# EAGLE design gt_cam_revf (EAGLE 9.4.2)

## Sheet 1 of 3
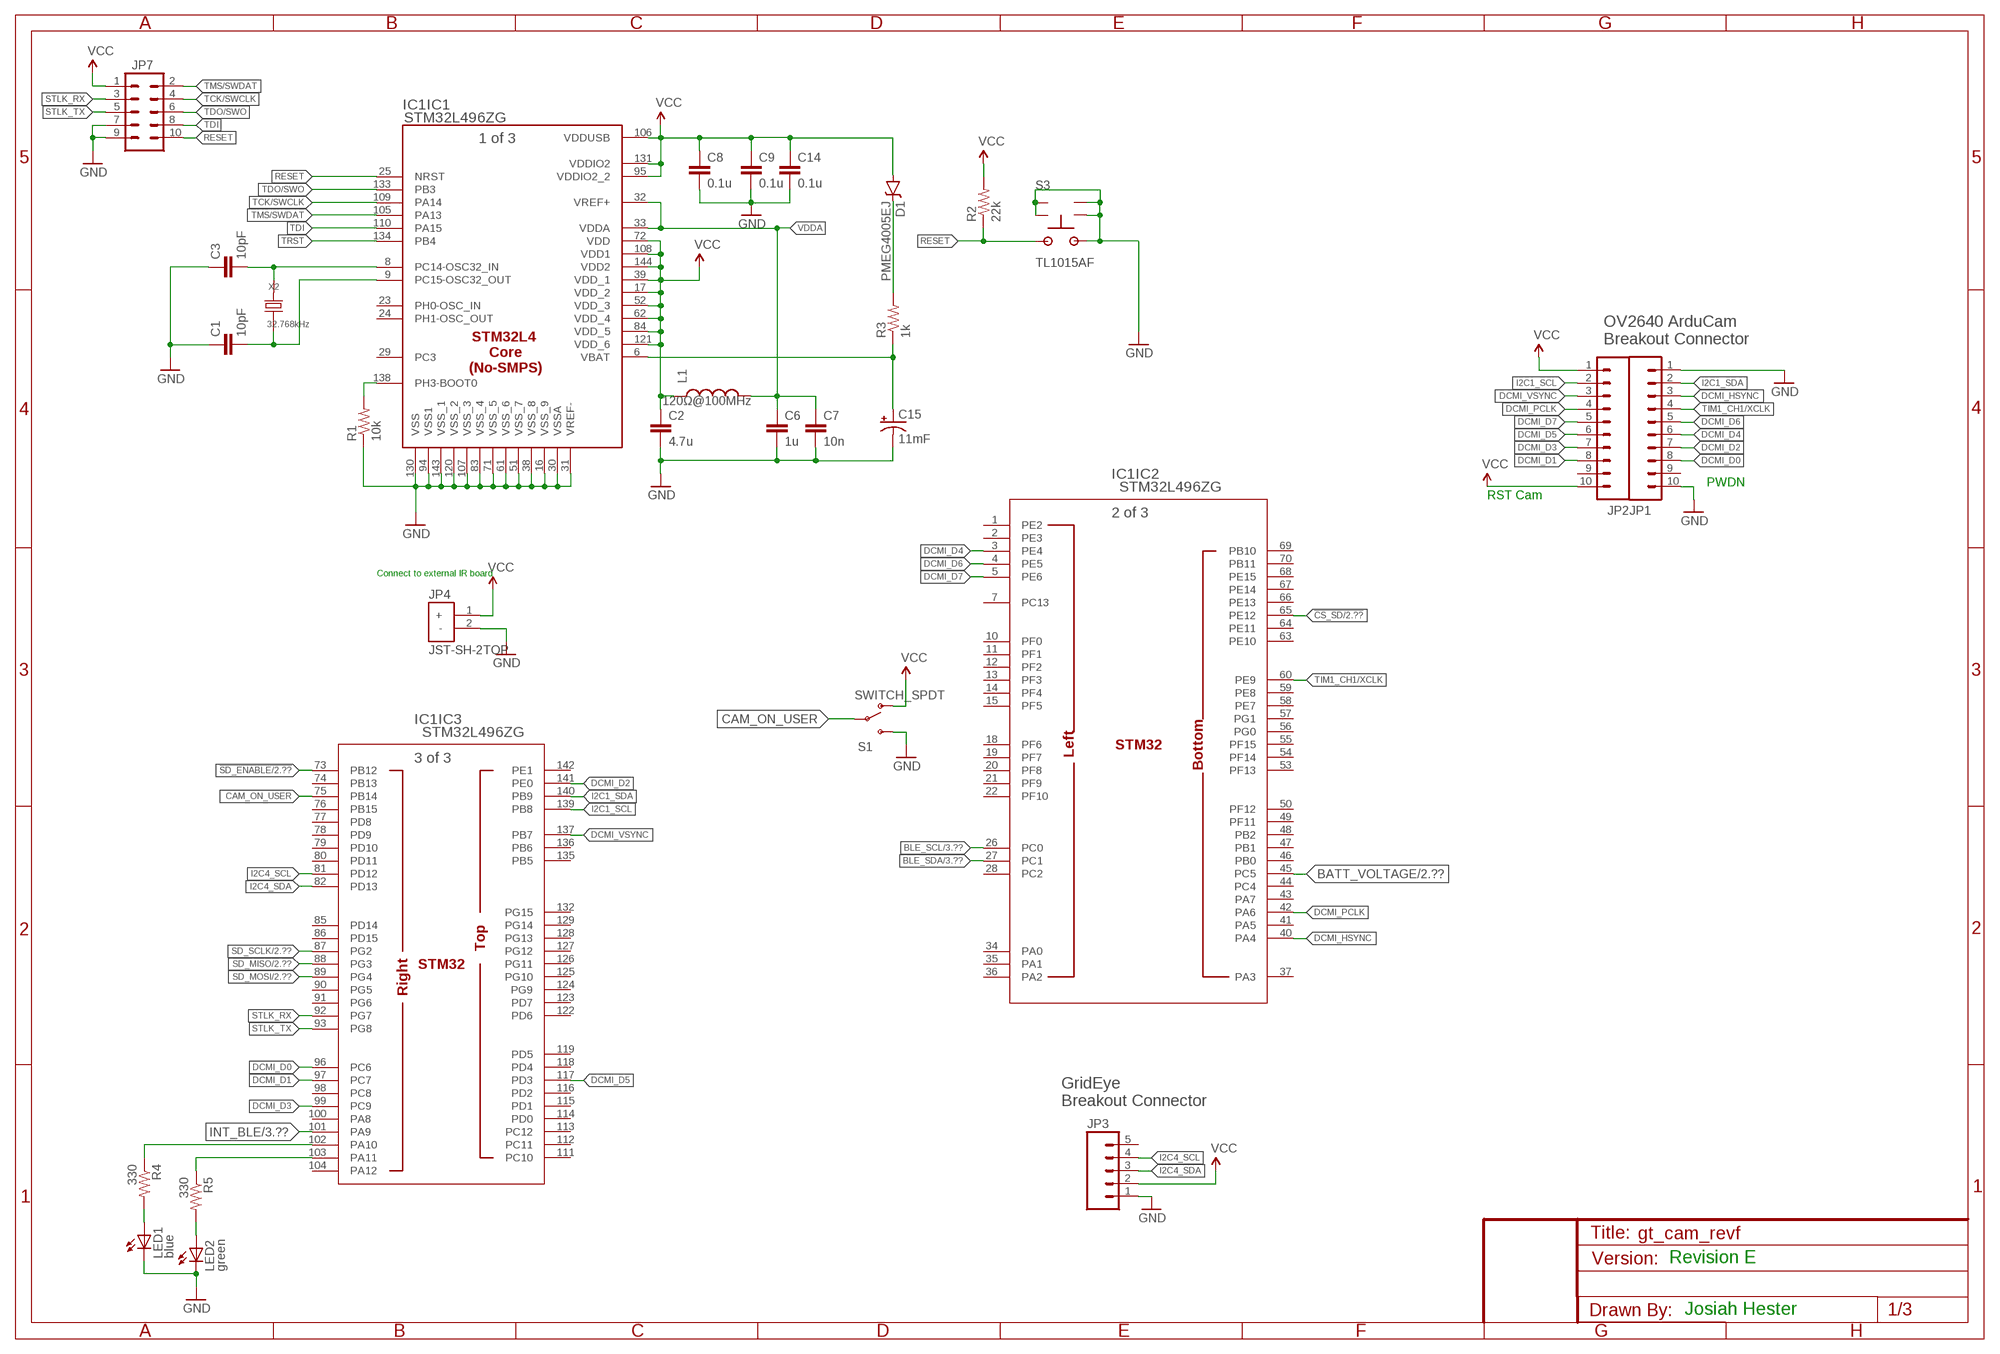
[diagram p0: schematic, sheet 1]

### Parts
C1  10pF  C-EU0603  [0603]
C2  4.7u  CAP0805  [0805]
C3  10pF  C-EU0603  [0603]
C6  1u  C-EU0603  [0603]
C7  10n  C-EU0603  [0603]
C8  0.1u  C-EU0603  [0603]
C9  0.1u  C-EU0603  [0603]
C14  0.1u  C-EU0603  [0603]
C15  11mF  CAP_POL1206  [EIA3216]
D1  PMEG4005EJ  DIODE-SCHOTTKY-PMEG4005EJ  [SOD-323]
IC1  STM32L496ZG  [LQFP144-20X20MM]
JP1  M10SILK_FEMALE_PTH  [1X10]
JP2  M10SILK_FEMALE_PTH  [1X10]
JP3  M05LOCK  [1X05_LOCK]
JP4  JST-SH-2TOP  [JST-SH-2-TOP]
JP7  M05X21.27MM  [2X5_1.27MM]
L1  120Ω@100MHz  L-EU  [0402]
LED1  blue  LED0603  [LED-0603]
LED2  green  LED0603  [LED-0603]
R1  10k  R-EU0603  [0603]
R2  22k  R-EU0603  [0603]
R3  1k  R-EU0603  [0603]
R4  330  R-EU0603  [0603]
R5  330  R-EU0603  [0603]
S1  SWITCH_SPDT  [EG-1213]
S3  TL1015AF  [TS1015]
X2  32.768kHz  FC-135  [FC-135_1PRIMARY]

### Nets
!CS_SD: IC1.65(IC2:PE12) ; also sheet 2
!SD_ENABLE: IC1.73(IC3:PB12) ; also sheet 2
BATT_VOLTAGE: IC1.45(IC2:PC5) ; also sheet 2
BLE_SCL: IC1.26(IC2:PC0) ; also sheet 3
BLE_SDA: IC1.27(IC2:PC1) ; also sheet 3
CAM_ON_USER: IC1.75(IC3:PB14) S1.C
DCMI_D0: IC1.96(IC3:PC6) JP1.8
DCMI_D1: IC1.97(IC3:PC7) JP2.8
DCMI_D2: IC1.141(IC3:PE0) JP1.7
DCMI_D3: IC1.99(IC3:PC9) JP2.7
DCMI_D4: IC1.3(IC2:PE4) JP1.6
DCMI_D5: IC1.117(IC3:PD3) JP2.6
DCMI_D6: IC1.4(IC2:PE5) JP1.5
DCMI_D7: IC1.5(IC2:PE6) JP2.5
DCMI_HSYNC: IC1.40(IC2:PA4) JP1.3
DCMI_PCLK: IC1.42(IC2:PA6) JP2.4
DCMI_VSYNC: IC1.137(IC3:PB7) JP2.3
GND: C1.1 C2.2 C3.1 C6.2 C7.2 C8.2 C9.2 C14.2 C15.C(-) IC1.16(IC1:VSS_9) IC1.30(IC1:VSSA) IC1.31(IC1:VREF-) IC1.38(IC1:VSS_8) IC1.51(IC1:VSS_7) IC1.61(IC1:VSS_6) IC1.71(IC1:VSS_5) IC1.83(IC1:VSS_4) IC1.94(IC1:VSS1) IC1.107(IC1:VSS_3) IC1.120(IC1:VSS_2) IC1.130(IC1:VSS) IC1.143(IC1:VSS_1) JP1.1 JP1.10 JP3.1 JP4.2(-) JP7.7 JP7.9 LED1.C LED2.C R1.1 S1.S S3.1 S3.G1(GND) S3.G2(GND) S3.G3(GND) S3.G4(GND) ; also sheet 2,3
I2C1_SCL: IC1.139(IC3:PB8) JP2.2
I2C1_SDA: IC1.140(IC3:PB9) JP1.2
I2C4_SCL: IC1.81(IC3:PD12) JP3.4
I2C4_SDA: IC1.82(IC3:PD13) JP3.3
INT_BLE: IC1.101(IC3:PA9) ; also sheet 3
N$1: C3.2 IC1.8(IC1:PC14-OSC32_IN) X2.2
N$2: C1.2 IC1.9(IC1:PC15-OSC32_OUT) X2.1
N$5: IC1.138(IC1:PH3-BOOT0) R1.2
N$8: D1.C R3.2
N$12: IC1.103(IC3:PA11) R5.1
N$13: IC1.102(IC3:PA10) R4.1
N$14: LED1.A R4.2
N$15: LED2.A R5.2
RESET: IC1.25(IC1:NRST) JP7.10 R2.1 S3.2
RTC_VBAT: C15.A(+) IC1.6(IC1:VBAT) R3.1
SD_MISO: IC1.88(IC3:PG3) ; also sheet 2
SD_MOSI: IC1.89(IC3:PG4) ; also sheet 2
SD_SCLK: IC1.87(IC3:PG2) ; also sheet 2
STLK_RX: IC1.92(IC3:PG7) JP7.3
STLK_TX: IC1.93(IC3:PG8) JP7.5
TCK/SWCLK: IC1.109(IC1:PA14) JP7.4
TDI: IC1.110(IC1:PA15) JP7.8
TDO/SWO: IC1.133(IC1:PB3) JP7.6
TIM1_CH1/XCLK: IC1.60(IC2:PE9) JP1.4
TMS/SWDAT: IC1.105(IC1:PA13) JP7.2
TRST: IC1.134(IC1:PB4)
VCC: C2.1 C8.1 C9.1 C14.1 D1.A IC1.17(IC1:VDD_2) IC1.39(IC1:VDD_1) IC1.52(IC1:VDD_3) IC1.62(IC1:VDD_4) IC1.72(IC1:VDD) IC1.84(IC1:VDD_5) IC1.95(IC1:VDDIO2_2) IC1.106(IC1:VDDUSB) IC1.108(IC1:VDD1) IC1.121(IC1:VDD_6) IC1.131(IC1:VDDIO2) IC1.144(IC1:VDD2) JP2.1 JP2.10 JP3.2 JP4.1(+) JP7.1 L1.1 R2.2 S1.P(O) ; also sheet 2,3
VDDA: C6.1 C7.1 IC1.32(IC1:VREF+) IC1.33(IC1:VDDA) L1.2
Unconnected: IC1.1(IC2:PE2) IC1.2(IC2:PE3) IC1.7(IC2:PC13) IC1.10(IC2:PF0) IC1.11(IC2:PF1) IC1.12(IC2:PF2) IC1.13(IC2:PF3) IC1.14(IC2:PF4) IC1.15(IC2:PF5) IC1.18(IC2:PF6) IC1.19(IC2:PF7) IC1.20(IC2:PF8) IC1.21(IC2:PF9) IC1.22(IC2:PF10) IC1.23(IC1:PH0-OSC_IN) IC1.24(IC1:PH1-OSC_OUT) IC1.28(IC2:PC2) IC1.29(IC1:PC3) IC1.34(IC2:PA0) IC1.35(IC2:PA1) IC1.36(IC2:PA2) IC1.37(IC2:PA3) IC1.41(IC2:PA5) IC1.43(IC2:PA7) IC1.44(IC2:PC4) IC1.46(IC2:PB0) IC1.47(IC2:PB1) IC1.48(IC2:PB2) IC1.49(IC2:PF11) IC1.50(IC2:PF12) IC1.53(IC2:PF13) IC1.54(IC2:PF14) IC1.55(IC2:PF15) IC1.56(IC2:PG0) IC1.57(IC2:PG1) IC1.58(IC2:PE7) IC1.59(IC2:PE8) IC1.63(IC2:PE10) IC1.64(IC2:PE11) IC1.66(IC2:PE13) IC1.67(IC2:PE14) IC1.68(IC2:PE15) IC1.69(IC2:PB10) IC1.70(IC2:PB11) IC1.74(IC3:PB13) IC1.76(IC3:PB15) IC1.77(IC3:PD8) IC1.78(IC3:PD9) IC1.79(IC3:PD10) IC1.80(IC3:PD11) IC1.85(IC3:PD14) IC1.86(IC3:PD15) IC1.90(IC3:PG5) IC1.91(IC3:PG6) IC1.98(IC3:PC8) IC1.100(IC3:PA8) IC1.104(IC3:PA12) IC1.111(IC3:PC10) IC1.112(IC3:PC11) IC1.113(IC3:PC12) IC1.114(IC3:PD0) IC1.115(IC3:PD1) IC1.116(IC3:PD2) IC1.118(IC3:PD4) IC1.119(IC3:PD5) IC1.122(IC3:PD6) IC1.123(IC3:PD7) IC1.124(IC3:PG9) IC1.125(IC3:PG10) IC1.126(IC3:PG11) IC1.127(IC3:PG12) IC1.128(IC3:PG13) IC1.129(IC3:PG14) IC1.132(IC3:PG15) IC1.135(IC3:PB5) IC1.136(IC3:PB6) IC1.142(IC3:PE1) JP1.9 JP2.9 JP3.5

### Notes on the sheet
- OV2640 ArduCam
  Breakout Connector
- PWDN
- RST Cam
- Connect to external IR board
- GridEye
  Breakout Connector
- Revision E
- Josiah Hester

## Sheet 2 of 3
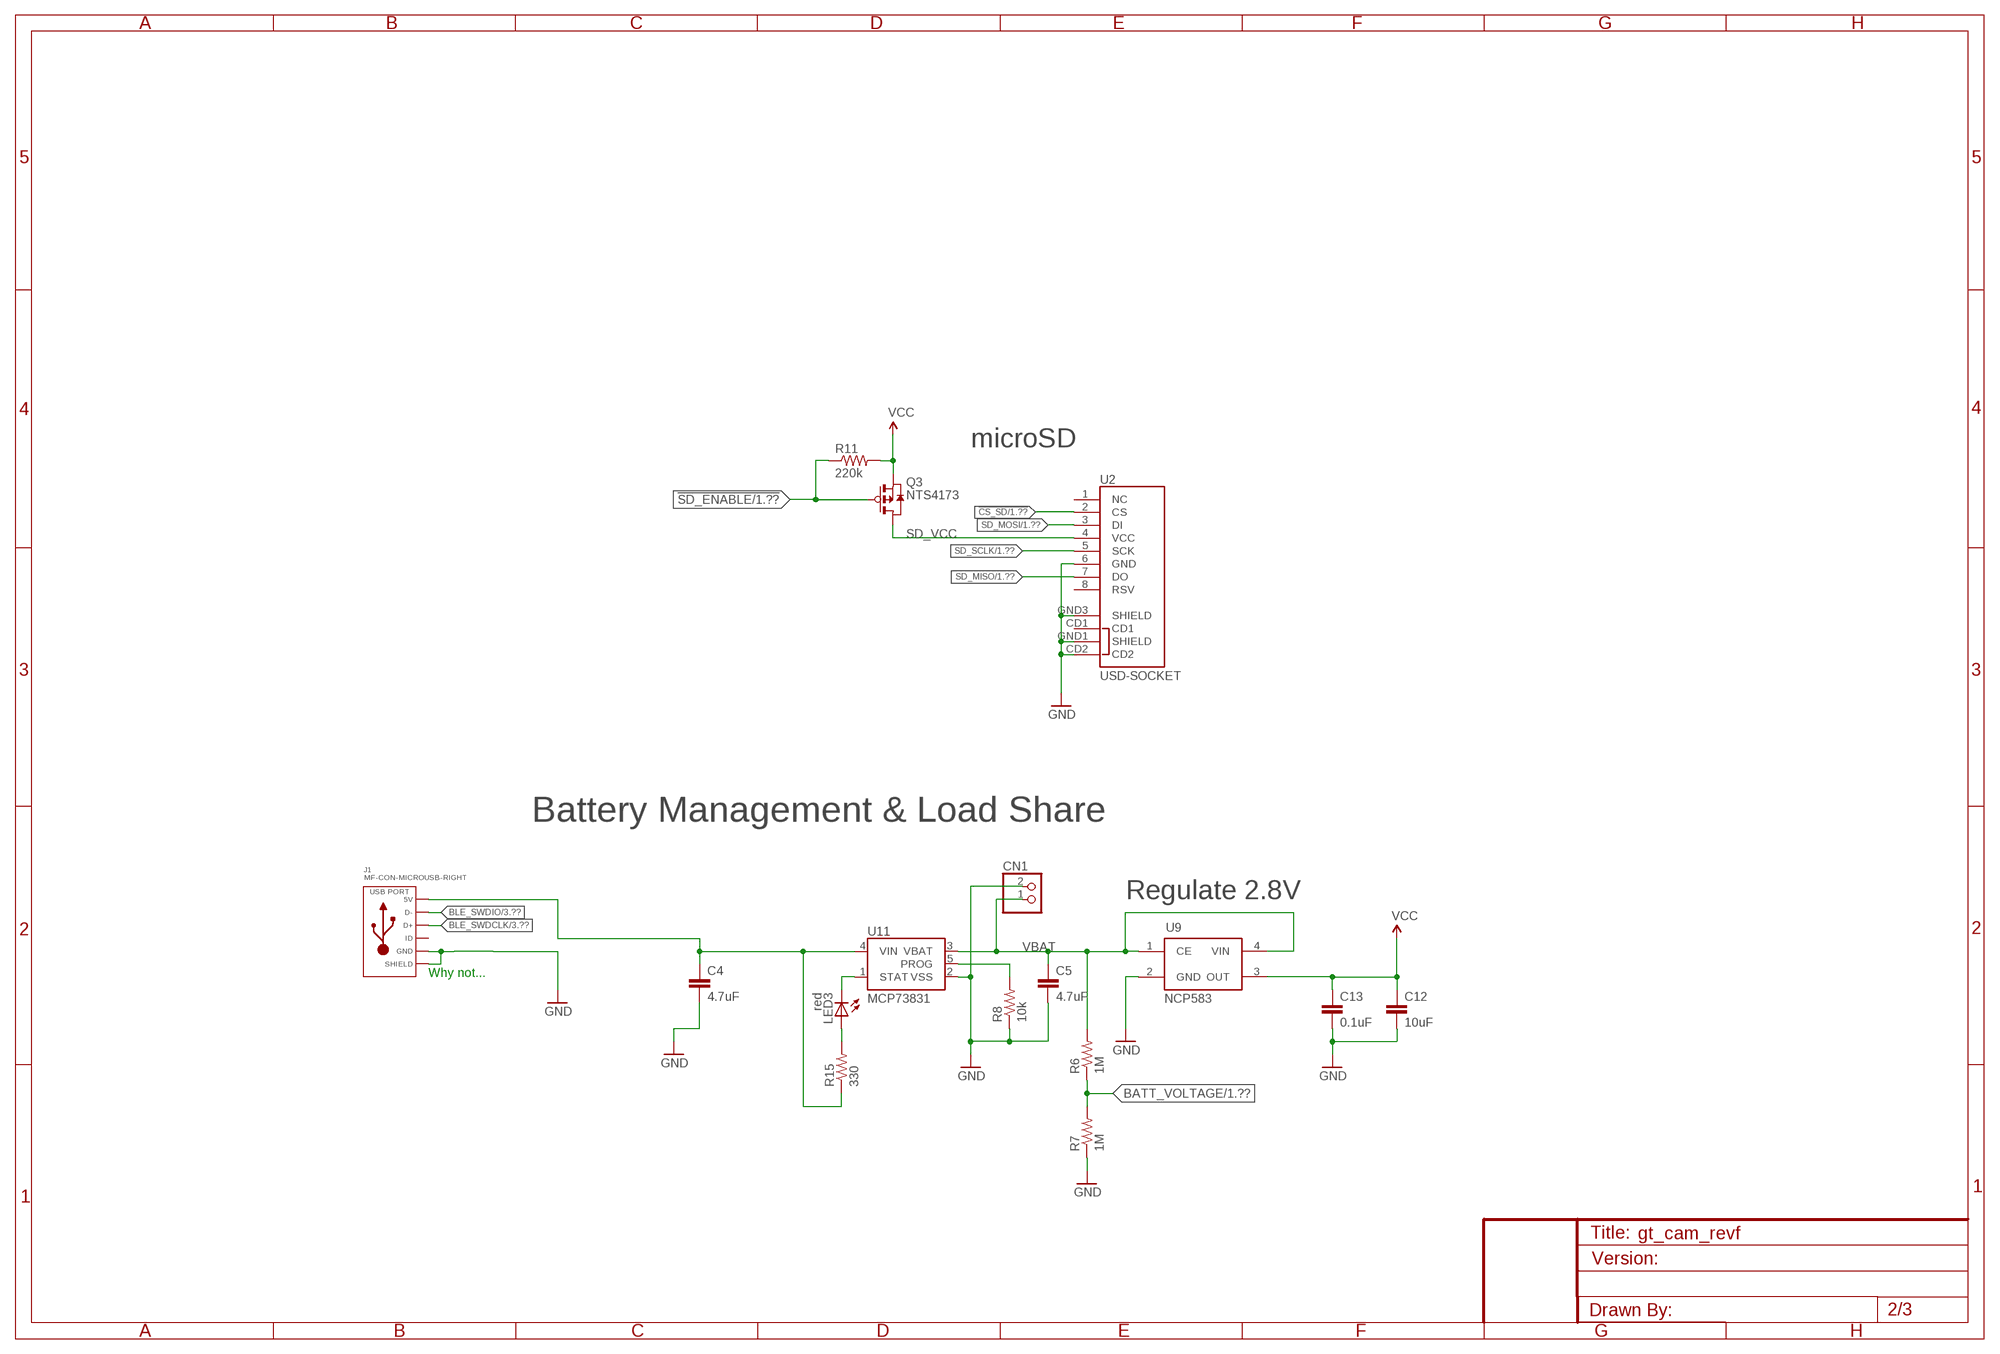
[diagram p1: schematic, sheet 2]

### Parts
C4  4.7uF  CAP0805  [0805]
C5  4.7uF  CAP0805  [0805]
C12  10uF  CAP0805  [0805]
C13  0.1uF  C-EU0603  [0603]
CN1  JST_2PIN-SMT-RA  [JST-PH-2-SMT-RA]
J1  MF-CON-MICROUSB-RIGHT  USB_MICRO_RIGHT  [MICROUSB-RIGHT]
LED3  red  LED0603  [LED-0603]
Q3  NTS4173  [SC-70-3]
R6  1M  R-EU0603  [0603]
R7  1M  R-EU0603  [0603]
R8  10k  R-EU0603  [0603]
R11  220k  R-EU0603  [0603]
R15  330  R-EU0603  [0603]
U2  USD-SOCKET  [MICROSD_1:1]
U9  NCP583  [SC82-AB_1PRIMARY]
U11  MCP73831  [SOT23-5]

### Nets
!CS_SD: U2.2(CS) ; also sheet 1
!SD_ENABLE: Q3.P1(G) R11.1 ; also sheet 1
BATT_VOLTAGE: R6.1 R7.2 ; also sheet 1
BLE_SWDCLK: J1.3(D+) ; also sheet 3
BLE_SWDIO: J1.2(D-) ; also sheet 3
GND: C4.2 C5.2 C12.2 C13.2 CN1.2 J1.5(GND) J1.S1(SLD) J1.S2(SLD) J1.S3(SLD) J1.S4(SLD) J1.S5(SLD) J1.S6(SLD) R7.1 R8.1 U2.6(GND) U2.CD2 U2.GND1(SHIELD) U2.GND3(SHIELD) U9.2(GND) U11.2(VSS) ; also sheet 1,3
MOB: C4.1 J1.1(5V) R15.1 U11.4(VIN)
N$6: R8.2 U11.5(PROG)
N$7: LED3.C U11.1(STAT)
N$9: LED3.A R15.2
SD_MISO: U2.7(DO) ; also sheet 1
SD_MOSI: U2.3(DI) ; also sheet 1
SD_SCLK: U2.5(SCK) ; also sheet 1
SD_VCC: Q3.P3(D) U2.4(VCC)
VBAT: C5.1 CN1.1 R6.2 U9.1(CE) U9.4(VIN) U11.3(VBAT)
VCC: C12.1 C13.1 Q3.P2(S) R11.2 U9.3(OUT) ; also sheet 1,3
Unconnected: J1.4(ID) U2.1(NC) U2.8(RSV) U2.CD1

### Notes on the sheet
- microSD
- Battery Management & Load Share
- Regulate 2.8V
- Why not...

## Sheet 3 of 3
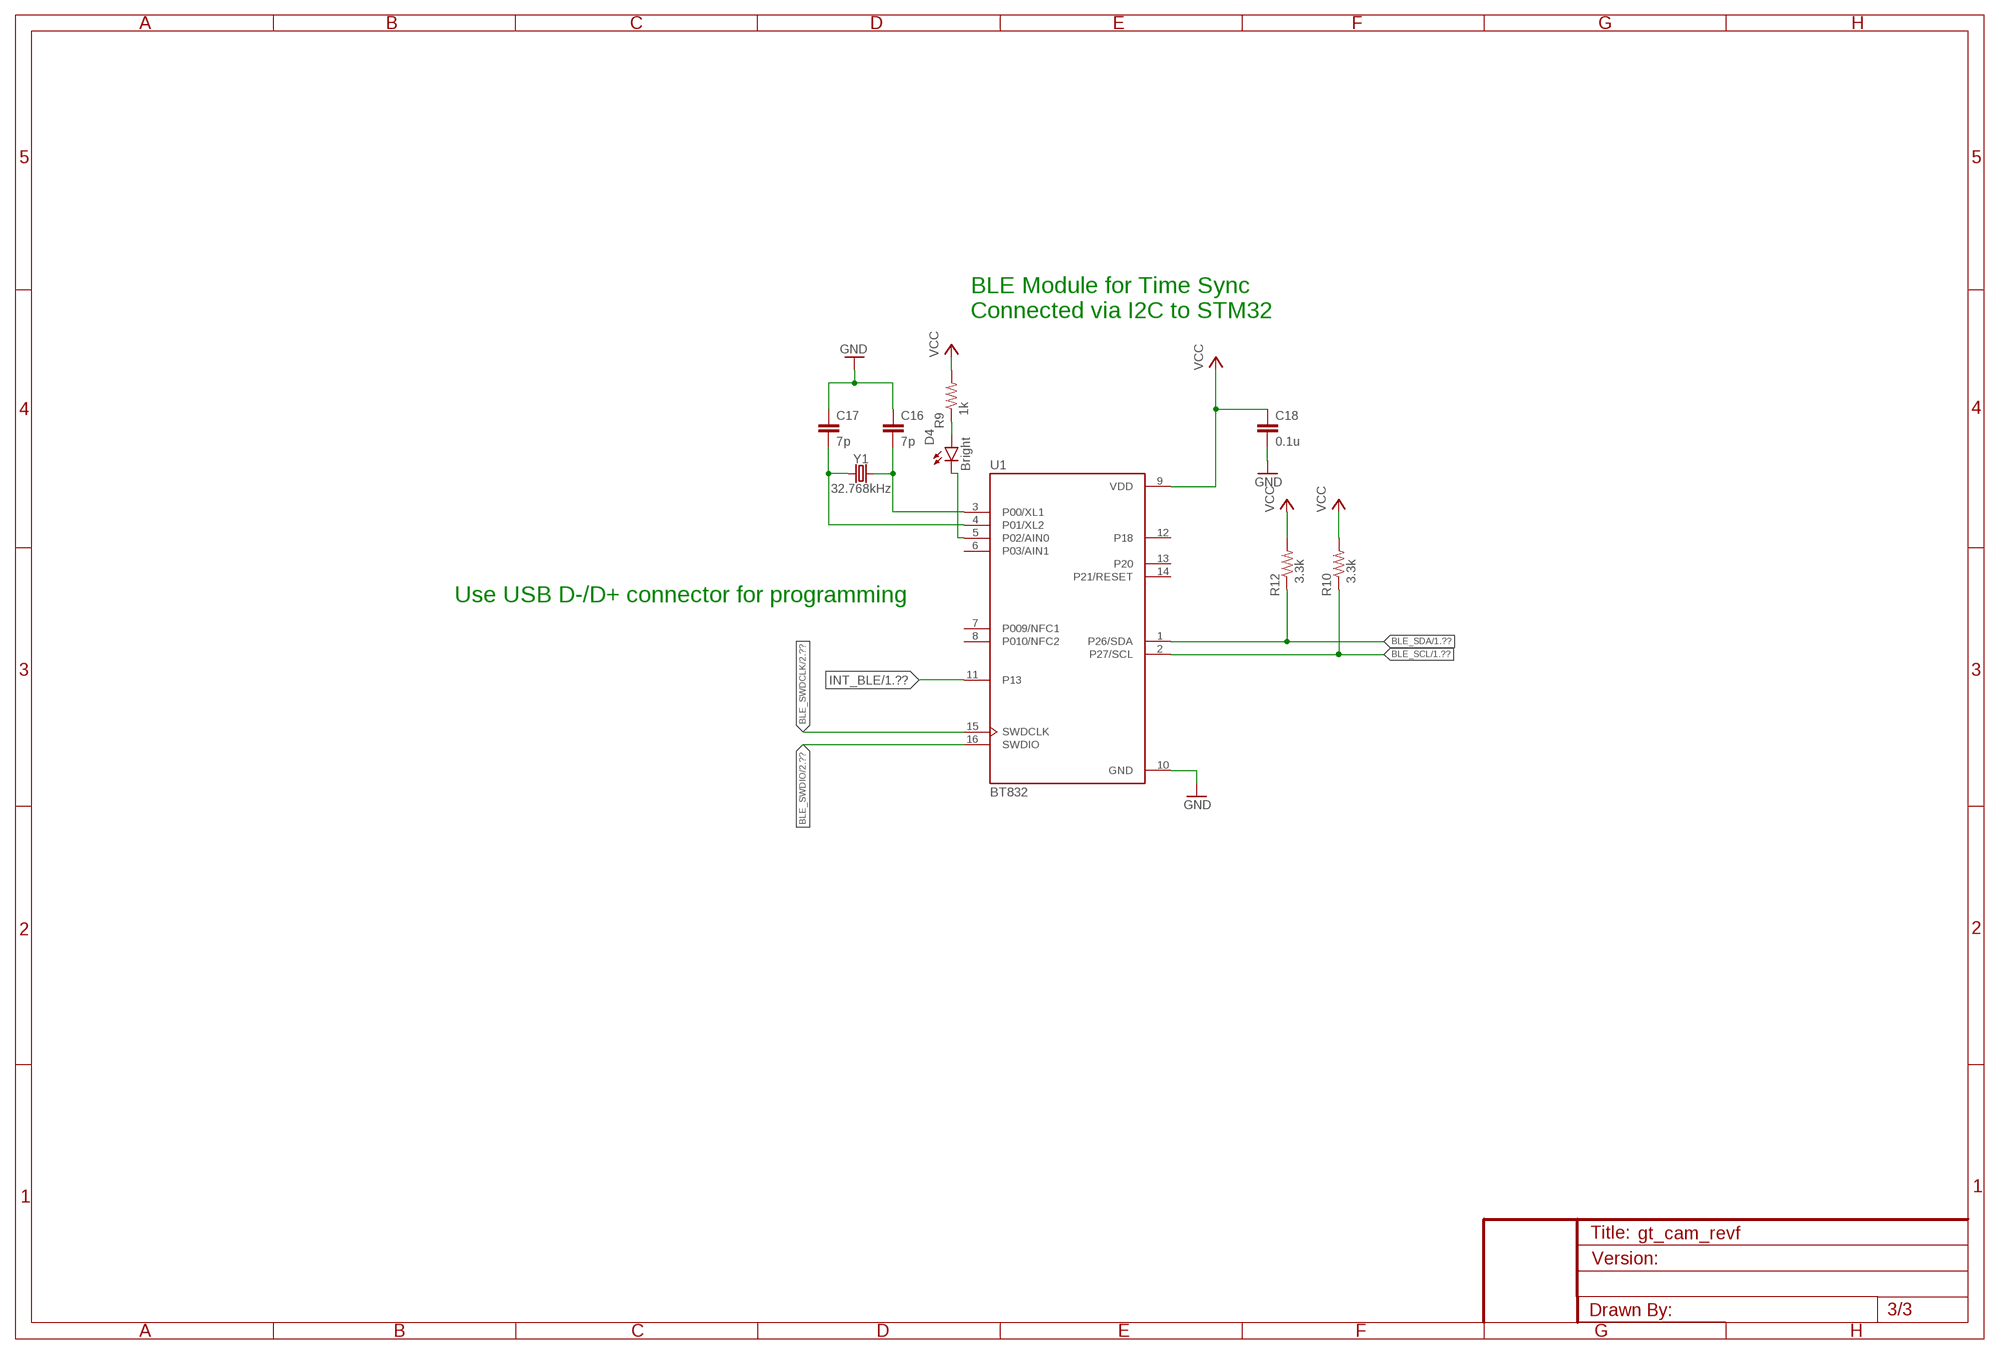
[diagram p2: schematic, sheet 3]

### Parts
C16  7p  C-EU0603  [0603]
C17  7p  C-EU0603  [0603]
C18  0.1u  C-EU0603  [0603]
D4  Bright  LED0603  [LED-0603]
R9  1k  R-EU0603  [0603]
R10  3.3k  R-EU0603  [0603]
R12  3.3k  R-EU0603  [0603]
U1  BT832  [BLEMODULE_BT832]
Y1  32.768kHz  CRYSTAL-32.768KHZSMD-3.2X1.5  [CRYSTAL-SMD-3.2X1.5MM]

### Nets
BLE_SCL: R10.1 U1.2(P27/SCL) ; also sheet 1
BLE_SDA: R12.1 U1.1(P26/SDA) ; also sheet 1
BLE_SWDCLK: U1.15(SWDCLK) ; also sheet 2
BLE_SWDIO: U1.16(SWDIO) ; also sheet 2
GND: C16.1 C17.1 C18.2 U1.10(GND) ; also sheet 1,2
INT_BLE: U1.11(P13) ; also sheet 1
N$3: D4.A R9.1
N$4: D4.C U1.5(P02/AIN0)
N$16: C16.2 U1.3(P00/XL1) Y1.P$2
N$20: C17.2 U1.4(P01/XL2) Y1.P$1
VCC: C18.1 R9.2 R10.2 R12.2 U1.9(VDD) ; also sheet 1,2
Unconnected: U1.6(P03/AIN1) U1.7(P009/NFC1) U1.8(P010/NFC2) U1.12(P18) U1.13(P20) U1.14(P21/RESET)

### Notes on the sheet
- BLE Module for Time Sync
  Connected via I2C to STM32
- Use USB D-/D+ connector for programming

## Library data of the parts
C1 C3 C6-C9 C13 C14 C16-C18 = tiny_passives:C-EU
C2 C4 C5 C12 = SparkFun-Capacitors:CAP: Capacitor Standard 0603 ceramic capacitor, and 0.1" leaded capacitor.
C15 = SparkFun-Capacitors:CAP_POL: Capacitor Polarized These are standard SMD and PTH capacitors. Normally 10uF, 47uF, and 100uF in electrolytic and tantalum varieties. Always verify the external diameter of the through hole cap, it varies with capacity, voltage, and manufacturer. The EIA devices should be standard.; DIGIKEY: 728-1067-1-ND
CN1 = adafruit:JST_2PIN: JST 2-Pin Connectors of various flavors SMT-RA (S2B-PH-SM4) 4UConnector #17311 SMT (B2B-PH-SM4) THM-RA (S2B-PH) THM (B2B-PH)
D1 = SparkFun-DiscreteSemi:DIODE-SCHOTTKY: Schottky diodes in SFE's production catalog BAT20J 1A 23V 0.62Vf RB751 120mA 40V 0.37Vf PMEG4005EJ 0.5A 40V 0.42Vf MBRA140 1A 40V 0.5Vf B340A 3A 40V SMA; PROD_ID: DIO-10955
D4 = necklace_done:LED: LED (Generic) Standard schematic elements and footprints for 5mm, 3mm, 1206, and 0603 sized LEDs. Generic LEDs with no color specified.
IC1 = stm32l496zg:STM32L496ZG: STM32L496xx: Ultra-low-power Arm® Cortex®-M4 32-bit MCU+FPU, 100DMIPS, up to 1MB Flash, 320KB SRAM, USB OTG FS, audio, ext. SMPS The STM32L496xx devices are the ultra-low-power microcontrollers based on the high- performance Arm® Cortex®-M4 32-bit RISC core operating at a frequency of up to 80 MHz. The Cortex-M4 core features a Floating point unit (FPU) single precision which supports all Arm® single-precision data-processing instructions and data types. It also implements a full set of DSP instructions and a memory protection unit (MPU) which enhances application security. The STM32L496xx devices embed high-speed memories (up to 1 Mbyte of Flash memory, 320 Kbyte of SRAM), a flexible external memory controller (FSMC) for static memories (for devices with packages of 100 pins and more), a Quad SPI flash memories interface (available on all packages) and an extensive range of enhanced I/Os and peripherals connected to two APB buses, two AHB buses and a 32-bit multi-AHB bus matrix.; DIGIKEY: 497-17999-ND
J1 = MF_Connectors:USB: Library: MF_Connectors Description: 5 Pin USB Connectors. SLD is the shield connection. Usually tied to ground through a small ferrite bead.; HOUSEPART: YES; MPN: MF-CON-MICROUSB-RIGHT; POPULATE: 1; URL: https://factory.macrofab.com/part/MF-CON-MICROUSB-RIGHT
JP1 JP2 = SparkFun-Connectors:M10: Header 10 Standard 10-pin 0.1" header. Use with straight break away headers (SKU : PRT-00116), right angle break away headers (PRT-00553), swiss pins (PRT-00743), machine pins (PRT-00117), and female headers (PRT-00115).; PROD_ID: CONN-11563
JP3 = SparkFun-Connectors:M05: Header 5 Standard 5-pin 0.1" header. Use with straight break away headers (SKU : PRT-00116), right angle break away headers (PRT-00553), swiss pins (PRT-00743), machine pins (PRT-00117), and female headers (PRT-00115). Molex polarized connector foot print use with SKU : PRT-08230 with associated crimp pins and housings.
JP4 = jst-sh:JST-SH-2
JP7 = SparkFun-Connectors:M05X2: Header 5x2 Standard 10-pin dual row 0.1" header. Commonly used with AVR-ISP. Use with Spark Fun Electronics SKU: PRT-00778; DIGIKEY: 1175-1627-ND
L1 = tiny_passives:L-EU; DIGIKEY: 490-4000-1-ND
LED1-LED3 = SparkFun-LED:LED: LEDs Standard schematic elements and footprints for 5mm, 3mm, 1206, and 0603 sized LEDs. 5mm - Spark Fun Electronics SKU : COM-00529 (and others)
Q3 = nts4173p:NTS4173: NTS4173P: Power MOSFET −30 V, −1.3 A, Single P−Channel, SC−70 Features • −30 V BVds, Low RDS(on) in SC−70 Package • Low Threshold Voltage • Fast Switching Speed • This is a Halide−Free Device • This is a Pb−Free Device Applications • Load Switch • Low Current Inverter and DC−DC Converters • Power Switch for Printers, Communication Equipment; DIGIKEY: NTS4173PT1GOSCT-ND
R1-R10 R12 R15 = tiny_passives:R-EU
R11 = tiny_passives:R-EU; DIGIKEY: RHM12.0KCDCT-ND
S1 = slider:SWITCH_SPDT: Side-actuated SPDT slide switch Works with 450302014072-ND and 563-1571-ND on Digikey.
S3 = eswitch:TL1015AF; MPN: TL1015AF160QG
U1 = bt832_min:BT832: BLE 5 Module: Nordic nRF52832 SoC, Cortex M4F with PCB trace antenna; DESCRIPTION: BLE 5 Module: Nordic nRF52832 SoC, Cortex M4F with PCB trace antenna; DIGI-KEY_PART_NUMBER: 1914-1013-1-ND; DIGI-KEY_PURCHASE_URL: https://www.digikey.com/product-detail/en/fanstel-corp/BT832/1914-1013-1-ND/8323666?utm_adgroup=RF%20&%20RFID; MF: Fanstel Corp.; MP: BT832; PACKAGE: SMD-16 Fanstel; PRICE: None
U2 = SparkFun-Connectors:USD-SOCKET: microSD Socket Push-push type uSD socket. Schematic element and footprint production proven. Spark Fun Electronics SKU : PRT-00127. tDoc lines correctly indicate media card edge positions when inserting (unlocked, locked, depressed). NOTE: CD1 and CD2 are connected internally; DIGIKEY: WM3290CT-ND; PROD_ID: CONN-07820
U9 = ncp583:NCP583: NCP583 - Ultra-Low Iq 150 mA CMOS LDO Regulator with Enable The NCP583 series of low dropout regulators are designed for portable battery powered applications which require precise output voltage accuracy and low quiescent current. These devices feature an enable function which lowers current consumption significantly and are offered in two small packages; SC−82AB and the SOT−563. A 1.0 mF ceramic capacitor is the recommended value to be used with these devices on the output pin.
U11 = SparkFun:MCP73831: Microchip's MCP73831 Miniature single cell, fully integrated Li-Ion, Li-polymer charge management controller http://ww1.microchip.com/downloads/en/DeviceDoc/21984a.pdf
X2 = fc-135:FC-135
Y1 = necklace_done:CRYSTAL-32.768KHZ: 32.768kHz Crystal Frequency: 32.768kHz Frequency Stability: ±20ppm Load Capacitance: 12.5pF (PTH-2X6 & SMD-3.2X1.5), 6pF (SMD-2X6),7pF() SparkFun Products: SparkFun BigTime Watch Kit <https://www.sparkfun.com/products/11734> SparkFun nRF52832 Breakout <https://www.sparkfun.com/products/13990> SparkFun Real Time Clock Module <https://www.sparkfun.com/products/12708>; DIGI-KEY_PART_NUMBER: SER4271CT-ND; DIGI-KEY_PURCHASE_URL: https://www.digikey.com/product-detail/en/epson/FC-135-32.7680KA-AG5/SER4271CT-ND/7932258; PROD_ID: XTAL-13062

## Board
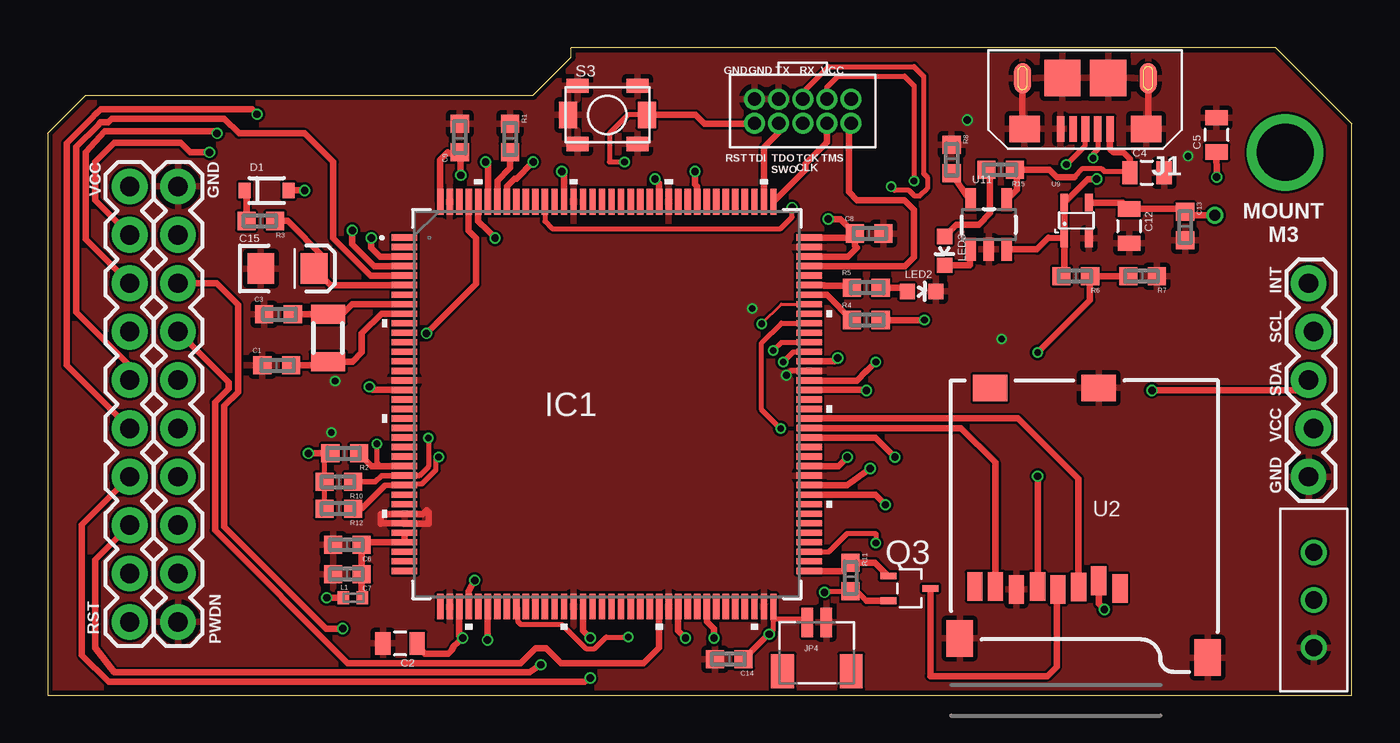
[diagram p3: board, top side]
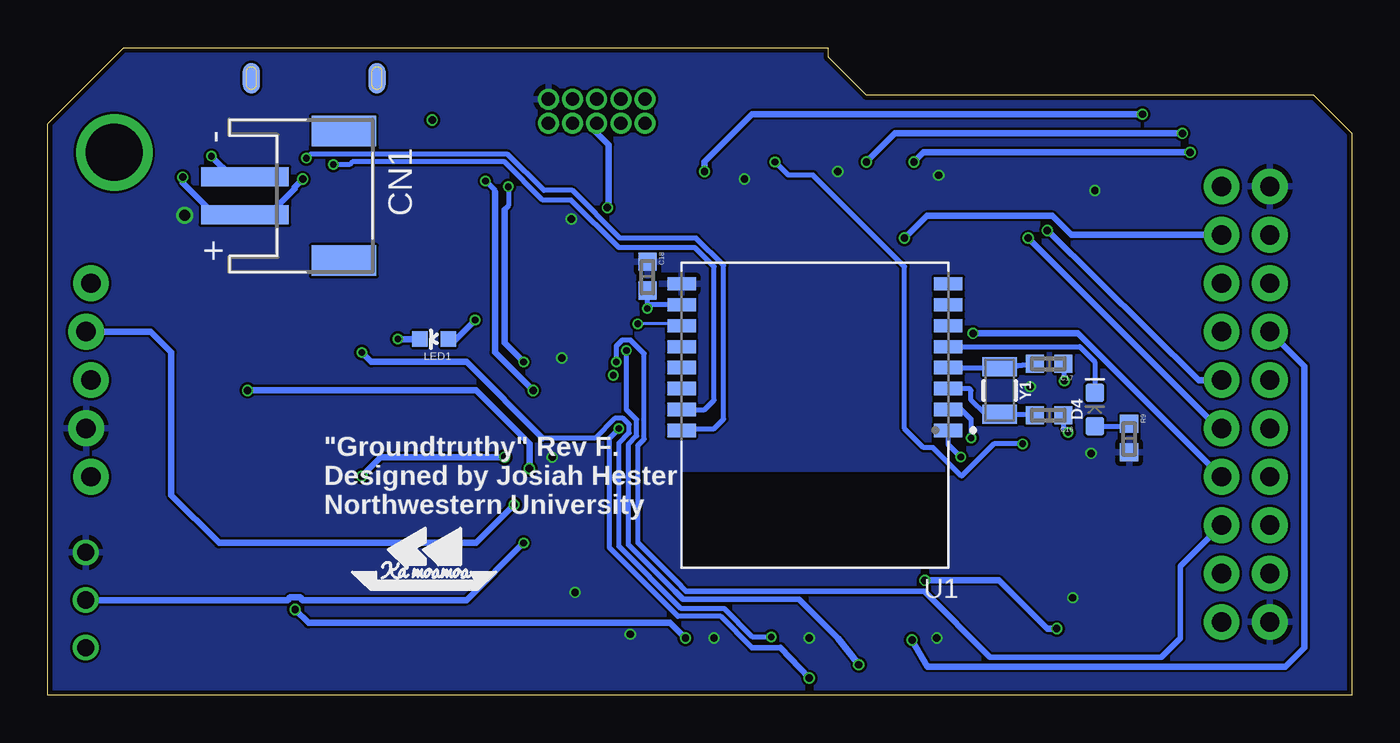
[diagram p4: board, bottom side, seen from below]

Size 68.5 x 34 mm. Coordinates in mm from the lower left corner, seen from the top.
Outline: 0,0 68.5,0 68.5,30 64.5,34 27.5,34 27.5,33.5 25.5,31.5 2,31.5 0,29.5 0,0
Copper layers (1*16): Top 0.035mm / dielectric 1.5mm / Bottom 0.035mm
Design rules "MF_Standard_2_Layer": minimum track width 5mil, minimum drill 10mil, track to track 5mil, track to pad 5mil, pad to pad 5mil, via to via 5mil, smd to smd 0mil, copper to edge 10mil, drill to drill 10mil, minimum pad ring 4mil, minimum via ring 4mil, stop-mask expansion 2mil, vias tented up to drill 25mil, thermal gap 10mil

### Footprints (pad centres in the part's own frame; a part is rotated, then mirrored left to right if it is on the bottom)
0603 = smd 0.95 x 0.95: 1 -0.75,0; 2 0.75,0
0805 = smd 0.8 x 1.2: 1 -0.9,0; 2 0.9,0
EIA3216 = smd 1.4 x 1.6: A 1.4,0; C -1.4,0
JST-PH-2-SMT-RA = smd 1 x 4.6: 1 1,-3.7; 2 -1,-3.7 | smd 1.6 x 3.4: NC1 -3.4,1.5; NC2 3.4,1.5
SOD-323 = smd 0.63 x 0.83: A 1.15,0; C -1.15,0
LED-0603 = smd 1 x 1: A -0.877,0; C 0.877,0
LQFP144-20X20MM = smd 1.346 x 0.33: 1 -10.625,8.75; 2 -10.625,8.25; 3 -10.625,7.75; 4 -10.625,7.25; 5 -10.625,6.75; 6 -10.625,6.25; 7 -10.625,5.75; 8 -10.625,5.25; 9 -10.625,4.75; 10 -10.625,4.25; 11 -10.625,3.75; 12 -10.625,3.25; 13 -10.625,2.75; 14 -10.625,2.25; 15 -10.625,1.75; 16 -10.625,1.25; 17 -10.625,0.75; 18 -10.625,0.25; 19 -10.625,-0.25; 20 -10.625,-0.75; 21 -10.625,-1.25; 22 -10.625,-1.75; 23 -10.625,-2.25; 24 -10.625,-2.75; 25 -10.625,-3.25; 26 -10.625,-3.75; 27 -10.625,-4.25; 28 -10.625,-4.75; 29 -10.625,-5.25; 30 -10.625,-5.75; 31 -10.625,-6.25; 32 -10.625,-6.75; 33 -10.625,-7.25; 34 -10.625,-7.75; 35 -10.625,-8.25; 36 -10.625,-8.75; 73 10.625,-8.75; 74 10.625,-8.25; 75 10.625,-7.75; 76 10.625,-7.25; 77 10.625,-6.75; 78 10.625,-6.25; 79 10.625,-5.75; 80 10.625,-5.25; 81 10.625,-4.75; 82 10.625,-4.25; 83 10.625,-3.75; 84 10.625,-3.25; 85 10.625,-2.75; 86 10.625,-2.25; 87 10.625,-1.75; 88 10.625,-1.25; 89 10.625,-0.75; 90 10.625,-0.25; 91 10.625,0.25; 92 10.625,0.75; 93 10.625,1.25; 94 10.625,1.75; 95 10.625,2.25; 96 10.625,2.75; 97 10.625,3.25; 98 10.625,3.75; 99 10.625,4.25; 100 10.625,4.75; 101 10.625,5.25; 102 10.625,5.75; 103 10.625,6.25; 104 10.625,6.75; 105 10.625,7.25; 106 10.625,7.75; 107 10.625,8.25; 108 10.625,8.75 | smd 0.33 x 1.346: 37 -8.75,-10.625; 38 -8.25,-10.625; 39 -7.75,-10.625; 40 -7.25,-10.625; 41 -6.75,-10.625; 42 -6.25,-10.625; 43 -5.75,-10.625; 44 -5.25,-10.625; 45 -4.75,-10.625; 46 -4.25,-10.625; 47 -3.75,-10.625; 48 -3.25,-10.625; 49 -2.75,-10.625; 50 -2.25,-10.625; 51 -1.75,-10.625; 52 -1.25,-10.625; 53 -0.75,-10.625; 54 -0.25,-10.625; 55 0.25,-10.625; 56 0.75,-10.625; 57 1.25,-10.625; 58 1.75,-10.625; 59 2.25,-10.625; 60 2.75,-10.625; 61 3.25,-10.625; 62 3.75,-10.625; 63 4.25,-10.625; 64 4.75,-10.625; 65 5.25,-10.625; 66 5.75,-10.625; 67 6.25,-10.625; 68 6.75,-10.625; 69 7.25,-10.625; 70 7.75,-10.625; 71 8.25,-10.625; 72 8.75,-10.625; 109 8.75,10.625; 110 8.25,10.625; 111 7.75,10.625; 112 7.25,10.625; 113 6.75,10.625; 114 6.25,10.625; 115 5.75,10.625; 116 5.25,10.625; 117 4.75,10.625; 118 4.25,10.625; 119 3.75,10.625; 120 3.25,10.625; 121 2.75,10.625; 122 2.25,10.625; 123 1.75,10.625; 124 1.25,10.625; 125 0.75,10.625; 126 0.25,10.625; 127 -0.25,10.625; 128 -0.75,10.625; 129 -1.25,10.625; 130 -1.75,10.625; 131 -2.25,10.625; 132 -2.75,10.625; 133 -3.25,10.625; 134 -3.75,10.625; 135 -4.25,10.625; 136 -4.75,10.625; 137 -5.25,10.625; 138 -5.75,10.625; 139 -6.25,10.625; 140 -6.75,10.625; 141 -7.25,10.625; 142 -7.75,10.625; 143 -8.25,10.625; 144 -8.75,10.625
MICROUSB-RIGHT = smd 0.4 x 1.35: 1 -1.3,1.27; 2 -0.65,1.27; 3 0,1.27; 4 0.65,1.27; 5 1.3,1.27 | smd 0.9 x 1.6: S1 -3.3,-1.4; S2 3.3,-1.4 | smd 1.6 x 1.4: S3 -3.2,1.27; S4 3.2,1.27 | smd 1.9 x 1.9: S5 -1.2,-1.405; S6 1.2,-1.405 | smd 0.9 x 1.6 bottom: S7 -3.3,-1.4; S8 3.3,-1.4
1X10 = drill 1.016 pad 1.88: 1 0,0; 2 2.54,0; 3 5.08,0; 4 7.62,0; 5 10.16,0; 6 12.7,0; 7 15.24,0; 8 17.78,0; 9 20.32,0; 10 22.86,0
1X05_LOCK = drill 1.016 pad 1.88: 1 0,0.127; 2 2.54,-0.127; 3 5.08,0.127; 4 7.62,-0.127; 5 10.16,0.127
JST-SH-2-TOP = smd 0.6 x 1.55: 1 -0.5,1.025; 2 0.5,1.025 | smd 1.2 x 1.8: P-MOUNT1 -1.8,-1.535; P-MOUNT2 1.8,-1.535
2X5_1.27MM = drill 0.7 pad 1.1: 1 0,0; 2 1.27,0; 3 0,-1.27; 4 1.27,-1.27; 5 0,-2.54; 6 1.27,-2.54; 7 0,-3.81; 8 1.27,-3.81; 9 0,-5.08; 10 1.27,-5.08
0402 = smd 0.6 x 0.7: 1 -0.5,0; 2 0.5,0
LED-0603' = smd 0.8 x 0.8: A 0,-0.75; C 0,0.75
SC-70-3 = smd 0.85 x 0.35: P1 -1.1,0.65; P2 -1.1,-0.65; P3 1.1,0
EG-1213 = drill 0.9: C 0,0; P 2.5,0; S -2.5,0
TS1015 = smd 0.95 x 1.4: 1 -2.075,0; 2 2.075,0 | smd 1.15 x 0.75: G1 -1.575,1.525; G2 1.575,1.525; G3 -1.575,-1.525; G4 1.575,-1.525
BLEMODULE_BT832 = smd 1.5 x 0.7: 1 -7,0.8; 2 -7,-0.3; 3 -7,-1.4; 4 -7,-2.5; 5 -7,-3.6; 6 -7,-4.7; 7 -7,-5.8; 8 -7,-6.9; 9 7,-6.9; 10 7,-5.8; 11 7,-4.7; 12 7,-3.6; 13 7,-2.5; 14 7,-1.4; 15 7,-0.3; 16 7,0.8
MICROSD_1:1 = smd 0.8 x 1.5: 1 5.096,10.919; 2 6.218,10.519; 3 7.274,10.853; 4 8.367,10.982; 5 9.421,10.828; 6 10.539,10.973; 7 11.648,10.819; 8 12.721,10.819 | smd 1.8 x 1.4: CD1 11.92,0.4; CD2 6.22,0.4 | smd 1.4 x 1.9: GND1 0.497,14.55; GND3 13.52,13.55
SC82-AB_1PRIMARY = smd 0.406 x 0.914: 1 -0.621,-0.913; 2 0.675,-0.913; 3 0.675,0.967; 4 -0.621,0.967
SOT23-5 = smd 0.55 x 1.2: 1 -0.95,-1.3; 2 0,-1.3; 3 0.95,-1.3; 4 0.95,1.3; 5 -0.95,1.3
FC-135_1PRIMARY = smd 0.991 x 1.803: 1 -1.245,0; 2 1.245,0
CRYSTAL-SMD-3.2X1.5MM = smd 1 x 1.8: P$1 -1.25,0; P$2 1.25,0

### Placement (x,y rotation side)
C1  12.03,17.32 0 top
C2  18.51,2.72 180 top
C3  12.13,20 0 top
C4  57.74,27.44 0 top
C5  61.39,29.42 90 top
C6  15.74,7.9 180 top
C7  15.74,6.36 180 top
C8  43.14,24.24 0 top
C9  21.65,29.25 90 top
C12  56.8,24.63 270 top
C13  59.74,24.63 270 top
C14  35.8,1.9 180 top
C15  12.6,22.4 0 top
C16  15.9,14.7 180 bottom
C17  15.9,17.4 180 bottom
C18  37,22 270 bottom
CN1  54.44,26.22 270 bottom
D1  11.5,26.5 0 top
D4  13.5,15 90 bottom
IC1  29.37,15.28 0 top
J1  54.5,31 180 top
JP1  6.85,26.71 270 top
JP2  4.31,26.71 270 top
JP3  66.35,11.47 90 top
JP4  40.4,2.8 0 top
JP7  42.2,31.3 270 top
L1  16.03,5.12 0 top
LED1  blue  [LED-0603']  48.2,18.7 90 bottom
LED2  green  [LED-0603']  45.9,21.2 270 top
LED3  red  [LED-0603']  47.11,23.33 180 top
Q3  45.26,5.61 0 top
R1  24.29,29.25 270 top
R2  15.6,12.7 180 top
R3  11.2,24.9 180 top
R4  43,19.7 0 top
R5  43,21.4 0 top
R6  54,22 180 top
R7  57.5,22 180 top
R8  47.48,28.16 270 top
R9  11.7,13.5 270 bottom
R10  15.3,11.2 180 top
R11  42.17,6.21 270 top
R12  15.3,9.8 180 top
R15  50.06,27.59 180 top
S1  66.5,5 90 top
S3  29.4,30.47 0 top
U1  28.2,14.7 180 bottom
U2  61.42,16.53 180 top
U9  54.01,24.9 0 top
U11  49.43,24.71 0 top
U$1  [KAMOAMOA]  52.5,5.5 0 bottom
X2  14.73,18.76 90 top
Y1  18.5,16 270 bottom

### Tracks (layer width: path | path; a pad name or v marks a point on that pad's centre or on a via)
!CS_SD  (via drill 0.39)
  Top 0.333: IC1.65 34.64,4.64 34.64,3.85 35,3.49 v35,3 | v55.5,4.5 55.2,4.8 U2.2
  Bottom 0.333: v55.5,4.5 54.8,3.8 35.8,3.8 v35,3
!SD_ENABLE
  Top 0.333: IC1.73 40.02,6.5 41.71,6.5 R11.1 43.46,6.96 Q3.P1
BATT_VOLTAGE  (via drill 0.35)
  Top 0.27: IC1.45 24.69,4.58 24.69,3.87 24.85,3.72 26.99,3.72 28.27,2.44 28.73,2.44 29.34,3.05 v30.5,3.05
  Top 0.33: v52,18 54.75,20.75 R6.1 R7.2
  Bottom 0.27: v30.5,3.05 31.47,3.05 32.96,4.54 35.23,4.54 38.5,7.81 38.5,13.24 37.96,13.78 37.96,14.22 38.28,14.54 38.72,14.54 39.76,13.5 42.5,13.5
  Bottom 0.33: 42.5,13.5 46.5,17.5 51.5,17.5 v52,18
BLE_SCL  (via drill 0.35)
  Top 0.27: v20,13.5 20,12 19.5,11.5 19.47,11.53 IC1.26
  Top 0.3: IC1.26 18.5,11.53 17.53,11.53 17.2,11.2 R10.1
  Bottom 0.27: U1.2 20.5,15 20,14.5 v20,13.5
BLE_SDA  (via drill 0.35)
  Top 0.27: IC1.27 18.82,11.1 19.66,11.1 20.4,11.84 20.4,12.36 v20.54,12.5
  Top 0.3: IC1.27 17.73,11.03 16.5,9.8 R12.1
  Bottom 0.27: v20.54,12.5 21.2,13.16 U1.1
BLE_SWDCLK  (via drill 0.35)
  Top 0.27: v53.5,27.86 54.5,28.86 J1.3
  Bottom 0.27: U1.15 34,15 33.5,15.5 33.5,22.5 34.5,23.5 38.5,23.5 41,26 42.5,26 44.5,28 52.5,28 52.64,27.86 v53.5,27.86
BLE_SWDIO  (via drill 0.35)
  Top 0.27: J1.2 55.15,28.65 54.91,28.41 v54.91,28.2
  Bottom 0.27: U1.16 35.1,14 33.5,14 33,14.5 33,22.56 34.44,24 38.44,24 40.94,26.5 42.44,26.5 44.34,28.4 54.7,28.4 v54.91,28.2
CAM_ON_USER  (via drill 0.35)
  Top 0.27: IC1.75 41.03,7.53 42,8.5 43.5,8.5 v43.5,8
  Bottom 0.33: v43.5,8 46.5,5 55.1,5 55.24,5.14 55.76,5.14 55.9,5 S1.C
DCMI_D0  (via drill 0.35)
  Top 0.27: v38.64,17.5 39.17,18.03 IC1.96
  Bottom 0.27: 35.5,6 37.5,8 37.5,13.12 37.17,13.45 37.17,17.93 37.88,18.64 38.32,18.64 38.64,18.32 v38.64,17.5
  Bottom 0.3: JP1.8 8.39,7.39 9,6.78 9,3 10,2 19,2 22.46,5.46 34.96,5.46 35.5,6
DCMI_D1  (via drill 0.35, 0.39)
  Top 0.27: v38.1,18.1 38.53,18.53 IC1.97
  Top 0.333: JP2.8 2.5,7.12 2.5,2.5 3.5,1.2 25.3,1.2 v25.9,1.6
  Bottom 0.27: 35.55,5.45 38,7.9 38,13.18 37.56,13.61 37.56,14.46 38.1,15 v38.1,18.1
  Bottom 0.3: 27,3 29.03,5.03 35.14,5.03 35.55,5.45
  Bottom 0.333: v25.9,1.6 27,3
DCMI_D2  (via drill 0.39)
  Top 0.33: 22.5,24 22.12,24.38 IC1.141
  Top 0.333: v19.9,19 22.5,21.6 22.5,24
  Bottom 0.333: JP1.7 14.38,19 v19.9,19
DCMI_D3  (via drill 0.35, 0.39)
  Top 0.27: IC1.99 38.53,19.53 37.5,18.5 37.5,15 v38.5,14
  Top 0.333: JP2.7 1.8,8.96 1.8,2.1 3.2,0.7 28.2,0.7 v28.5,0.9
  Bottom 0.27: 31.5,2.5 33.14,4.14 35.39,4.14 39,7.75 39,13.5 v38.5,14
  Bottom 0.3: 30,2.5 31.5,2.5
  Bottom 0.333: v28.5,0.9 30,2.5
DCMI_D4  (via drill 0.39)
  Top 0.333: IC1.3 17.47,23.03 17,23.5 v17,24
  Bottom 0.333: v17,24 7.01,14.01 JP1.6
DCMI_D5  (via drill 0.39)
  Top 0.333: JP2.6 1,17.32 1,28.97 2.3,30.27 2.55,30.55 2.58,30.55 2.78,30.76 10.74,30.76 v11,30.5 | v34,27.5 34,26.81 34.1,26.71 34.1,25.92 IC1.117
  Bottom 0.333: v11,30.5 31.5,30.5 34,28 v34,27.5
DCMI_D6  (via drill 0.39)
  Top 0.333: IC1.4 17.16,22.53 16,23.69 v16,24.4
  Bottom 0.333: v16,24.4 8.05,16.55 JP1.5
DCMI_D7
  Top 0.333: JP2.5 4.31,17.31 1.51,20.11 1.51,28.49 1.51,28.68 1.51,28.69 1.51,28.8 2.65,29.93 2.78,30.07 2.79,30.08 2.8,30.09 2.99,30.09 3,30.09 3.18,30.09 3.35,30.27 9.28,30.27 10.05,29.5 13.5,29.5 15,28 15,24 16.97,22.03 IC1.5
DCMI_HSYNC  (via drill 0.39)
  Top 0.333: IC1.40 22.11,4.67 22.11,5.46 v22.43,6.03 | JP1.3 8.87,21.63 10,20.5 10,15.91 9.28,15.19 9.28,8.85 14.63,3.5 v15.5,3.5
  Bottom 0.33: 18.53,6.03 v22.43,6.03
  Bottom 0.333: 18.53,6.03 16,3.5 v15.5,3.5
DCMI_PCLK  (via drill 0.39)
  Top 0.333: v23.1,2.9 23.1,3.85 23.1,4.64 IC1.42
  Bottom 0.333: JP2.4 2.5,17.28 2.5,2.5 3.5,1.5 22.3,1.5 v23.1,2.9
DCMI_VSYNC  (via drill 0.39)
  Top 0.33: IC1.137 24.12,26.72 24.52,27.12 24.62,27.12
  Top 0.333: JP2.3 2,23.94 2,28.5 3,29.6 8.8,29.6 v8.9,29.5 | 24.62,27.12 v25.5,28
  Bottom 0.333: v25.5,28 24,29.5 v8.9,29.5
GND  (via drill 0.35, 0.39)
  Top 0.27: IC1.94 39.03,17.03 v38.8,16.8
  Top 0.33: J1.S1 57.8,29.83 J1.S3 | J1.S2 51.2,29.83 J1.S4
  Top 0.333: IC1.31 17.53,9.03 17.5,9 17.5,9.5 19.7,9.5 19.9,9.7 20,9.6 20,9 19.56,9 19.55,9.02 18.76,9.02 IC1.31
  Bottom 0.27: v37,20.3 37,20.5 | 37,20.5 C18.2 | U1.10 37,20.5 | v15.1,16.5 15.1,17.35 C17.1 | C16.1 15.15,14.05 v14.9,13.8
  Bottom 0.33: CN1.2 58.82,27.22 v59.9,28.3 | v50.1,18.7 LED1.C
  other vias: 48.3,30.2
  pour Top: 0,0 68.66,0 68.66,34.56 0,34.56
I2C1_SCL  (via drill 0.39)
  Top 0.33: IC1.139 23.12,27.88 v23,28
  Top 0.333: JP2.2 2.5,25.98 2.5,28 3.5,29 7,29 7.5,28.5 v8.5,28.5
  Bottom 0.333: v8.5,28.5 22.5,28.5 v23,28
I2C1_SDA  (via drill 0.39)
  Top 0.33: IC1.140 22.62,24.88 23.12,24.38
  Top 0.333: 23.12,24.38 v23.5,24
  Bottom 0.333: JP1.2 14.72,24.17 15.72,25.17 22.33,25.17 v23.5,24
I2C4_SCL  (via drill 0.39)
  Top 0.333: IC1.81 43.47,10.53 v44,10
  Bottom 0.333: v44,10 46,8 59.5,8 62,10.5 62,18 63.09,19.09 JP3.4
I2C4_SDA  (via drill 0.39)
  Top 0.333: IC1.82 41.97,11.03 v43.2,11.9 | v58,16 65.67,16 JP3.3
  Bottom 0.333: v43.2,11.9 43.2,13.2 46,16 v58,16
INT_BLE  (via drill 0.35)
  Top 0.152: v37.5,19.5 38.53,20.53 IC1.101
  Bottom 0.152: U1.11 35.3,19.5 v37.5,19.5
MOB
  Top 0.27: 56.84,27.5 55.49,27.5 55.33,27.66 54.37,27.66 53.92,27.2
  Top 0.33: C4.1 56.84,27.5 56.84,28.16 56.5,28.5 56,28.5 55.8,28.7 J1.1
  Top 0.333: 53.92,27.2 53.01,27.2 52.62,27.59 R15.1 50.9,27.5 50.9,26.53 U11.4
N$1
  Top 0.333: IC1.8 16,20.53 15.47,20 X2.2 C3.2
N$2
  Top 0.333: IC1.9 17.53,20.03 16.5,19 16.5,18 16.02,17.52 X2.1 14.54,17.32 C1.2
N$3
  Bottom 0.27: D4.A 11.83,14.12 R9.1
N$4
  Bottom 0.27: U1.5 14.3,18.3 13.5,17.5 D4.C
N$5
  Top 0.33: IC1.138 23.62,27.02 24.3,27.7 24.3,28.15 24.12,28.33
  Top 0.333: 24.12,28.33 R1.2
N$6
  Top 0.333: R8.2 48.45,25.98 U11.5
N$7
  Top 0.333: U11.1 48.45,22.58 LED3.C
N$8
  Top 0.333: R3.2 10.45,26.4 D1.C
N$9
  Top 0.333: LED3.A 47.73,24.7 48.9,24.7 49.5,25.3 49.5,27.4 R15.2
N$11  (via drill 3)
  other vias: 65,28.5
N$12
  Top 0.33: IC1.103 40.01,21.51 40.8,21.51 40.81,21.5 42.15,21.5 R5.1
N$13
  Top 0.33: IC1.102 40.6,21.03 40.61,21.02 40.93,21.02 R4.1
N$14  (via drill 0.35)
  Top 0.33: R4.2 v46.05,19.7
  Bottom 0.33: LED1.A 47.24,18.51 v46.05,19.7
N$15
  Top 0.33: R5.2 44.95,21.4 LED2.A
N$16
  Bottom 0.27: U1.3 20.1,16.1 20,16 20,15.5 19.25,14.75 Y1.P$2 16.7,14.75 C16.2
N$20
  Bottom 0.27: U1.4 18.05,17.2 18,17.25
  Bottom 0.3: C17.2 18,17.25 Y1.P$1
RESET  (via drill 0.35)
  Top 0.27: 17.5,12.03 17.3,12.23 v17.3,13.2 | S3.2 30.47,30.47 29.5,29.5 29.5,28 v30.3,28
  Top 0.33: S3.2 33.5,30.47 34.03,30.47 34.5,30 37.09,30 JP7.10
  Top 0.333: IC1.25 17.5,12.03 17.02,12.03 R2.1
  Bottom 0.27: v17.3,13.2 18.8,13.2 20.5,11.5 22,13 22.5,13 23.5,14 23.5,22.5 28.3,27.3 29.6,27.3 v30.3,28
RTC_VBAT
  Top 0.333: IC1.6 14.87,21.53 C15.A 14,22.5 14.5,23 12.6,24.9 R3.1
SD_MISO
  Top 0.333: IC1.88 47.97,14.03 49.77,12.23 U2.7
SD_MOSI
  Top 0.333: IC1.89 50.97,14.53 54.15,11.35 U2.3
SD_SCLK  (via drill 0.39)
  Top 0.333: IC1.87 43.47,13.53 v44.5,12.5 | v52,11.5 U2.5
  Bottom 0.333: v44.5,12.5 51,12.5 v52,11.5
SD_VCC
  Top 0.33: Q3.P3 46.36,1 52.5,1 53,1.5 53,5.49 U2.4
STLK_RX  (via drill 0.35, 0.39)
  Top 0.27: JP7.3 40.93,31.93 41.5,32.5 45,32.5 45.5,32 v45.5,27
  Top 0.333: v43,16 42.97,16.03 IC1.92
  Bottom 0.27: v45.5,27 45,26.5 45,26.4
  Bottom 0.333: v43,16 45,18 45,26.4
STLK_TX  (via drill 0.35)
  Top 0.27: JP7.5 39.66,31.66 41,33 45.5,33 46,32.5 46,27.4 46.2,27.2 46.2,26.6 45.8,26.2 45.54,26.2 45.24,26.5 44.5,26.5 v44.3,26.7
  Top 0.33: 42.5,16.52 42.98,17 43,17 v43.5,17.5
  Top 0.333: 42.5,16.52 40.01,16.52 IC1.93
  Bottom 0.27: v44.3,26.7 44.3,25.7 44.5,25.5
  Bottom 0.33: v43.5,17.5 44.5,18.5 44.5,25.5
TCK/SWCLK
  Top 0.33: 39.81,27.59 39.81,27.91 40.93,29.03 JP7.4
  Top 0.333: IC1.109 39.81,27.59
TDI
  Top 0.33: IC1.110 37.62,28.76 38.39,29.53 JP7.8
TDO/SWO  (via drill 0.39)
  Top 0.27: v39.1,25.6 39.1,25.1 38.5,24.5 26.5,24.5 26.12,24.88 IC1.133
  Bottom 0.33: 39.04,25.66 39.04,28.91 39.66,29.53 JP7.6
  Bottom 0.333: v39.1,25.6 39.04,25.66
TIM1_CH1/XCLK
  Top 0.333: JP1.4 9.5,16.44 9.5,16.1 8.79,15.39 8.79,8.65 15.76,1.69 24.84,1.69 25.62,2.47 26.18,2.47 26.96,1.69 31.29,1.69 32.1,2.5 32.1,4.64 IC1.60
TMS/SWDAT
  Top 0.33: 42.08,26.42 42.08,29.91 JP7.2
  Top 0.333: 42.08,26.42 42.5,26 45,26 45.5,25.5 45.5,23 45.03,22.53 IC1.105
VBAT  (via drill 0.39)
  Top 0.33: R6.2 53.39,22.14 U9.1
  Top 0.333: v55.1,27.1 54.62,27.1 U9.4 U9.1 52.57,24.01 51.97,23.41 U11.3 | v61.4,27.2 61.4,27.33 C5.1
  Bottom 0.33: v55.1,27.1 55.52,26.68 55.52,26.59 56.89,25.22 CN1.1 59.72,25.22 61.4,26.9 v61.4,27.2
VCC  (via drill 0.39, 0.6)
  Top 0.27: R12.2 R10.2 14.55,12.4 R2.2 | v40.8,5.4 40.86,5.46 R11.2 42.5,5.46 43,4.96 | 37.65,3 37.9,3.25 37.9,3.28 v37.9,3.2 38.12,3.42 38.12,4 39.73,4 JP4.1
  Top 0.33: C13.1 59.92,25.2 v61.3,25.2
  Top 0.333: U9.3 56.46,25.87 C12.1 59.59,25.53 C13.1 | v21.7,27.3 21.7,28.45 | 21.7,28.45 C9.1 | IC1.144 20.62,28.12 21,28.5 21.05,28.45 21.7,28.45 | IC1.17 17.07,16.03 v16.9,16.2 | IC1.52 28.12,3.38 v28.5,3 | IC1.62 33.12,3.38 v33.5,3 | IC1.39 21.62,3.12 v21.8,3 21.33,2.57 21.25,2.4 21.03,2.17 19.81,2.17 C2.1 | 38.12,4 IC1.72 | C14.1 37.65,3 | IC1.108 42.18,24.03 C8.1 | v41,25 41.63,25 C8.1 | IC1.106 42.03,23.03 42.5,23.5 42.39,23.61 C8.1 | v41.5,17.7 41.33,17.53 IC1.95 | IC1.84 41.53,12.03 v42,12.5 | IC1.131 27.12,27.38 v27,27.5 | IC1.121 32.12,26.88 v31.9,27.1 | L1.1 v14.66,5.12 | Q3.P2 43,4.96 | v13.5,26.5 D1.A | v13.7,12.7 R2.2
  pour Bottom: 0,34.56 68.43,34.56 68.43,0 0,0
VDDA
  Top 0.333: IC1.32 IC1.33 16.62,8.03 C6.1 C7.1 16.49,5.58 L1.2

### Text on the board
tPlace: GND | GND | TX | RX | VCC | RST | TDI | TDO | CLK | TCK | TMS | SWO | VCC | GND | MOUNT / M3 | INT | SCL | SDA | VCC | GND | RST | PWDN
bPlace: "Groundtruthy" Rev F. / Designed by Josiah Hester / Northwestern University